# EAGLE schematic opentempescope (EAGLE 7.2.0)
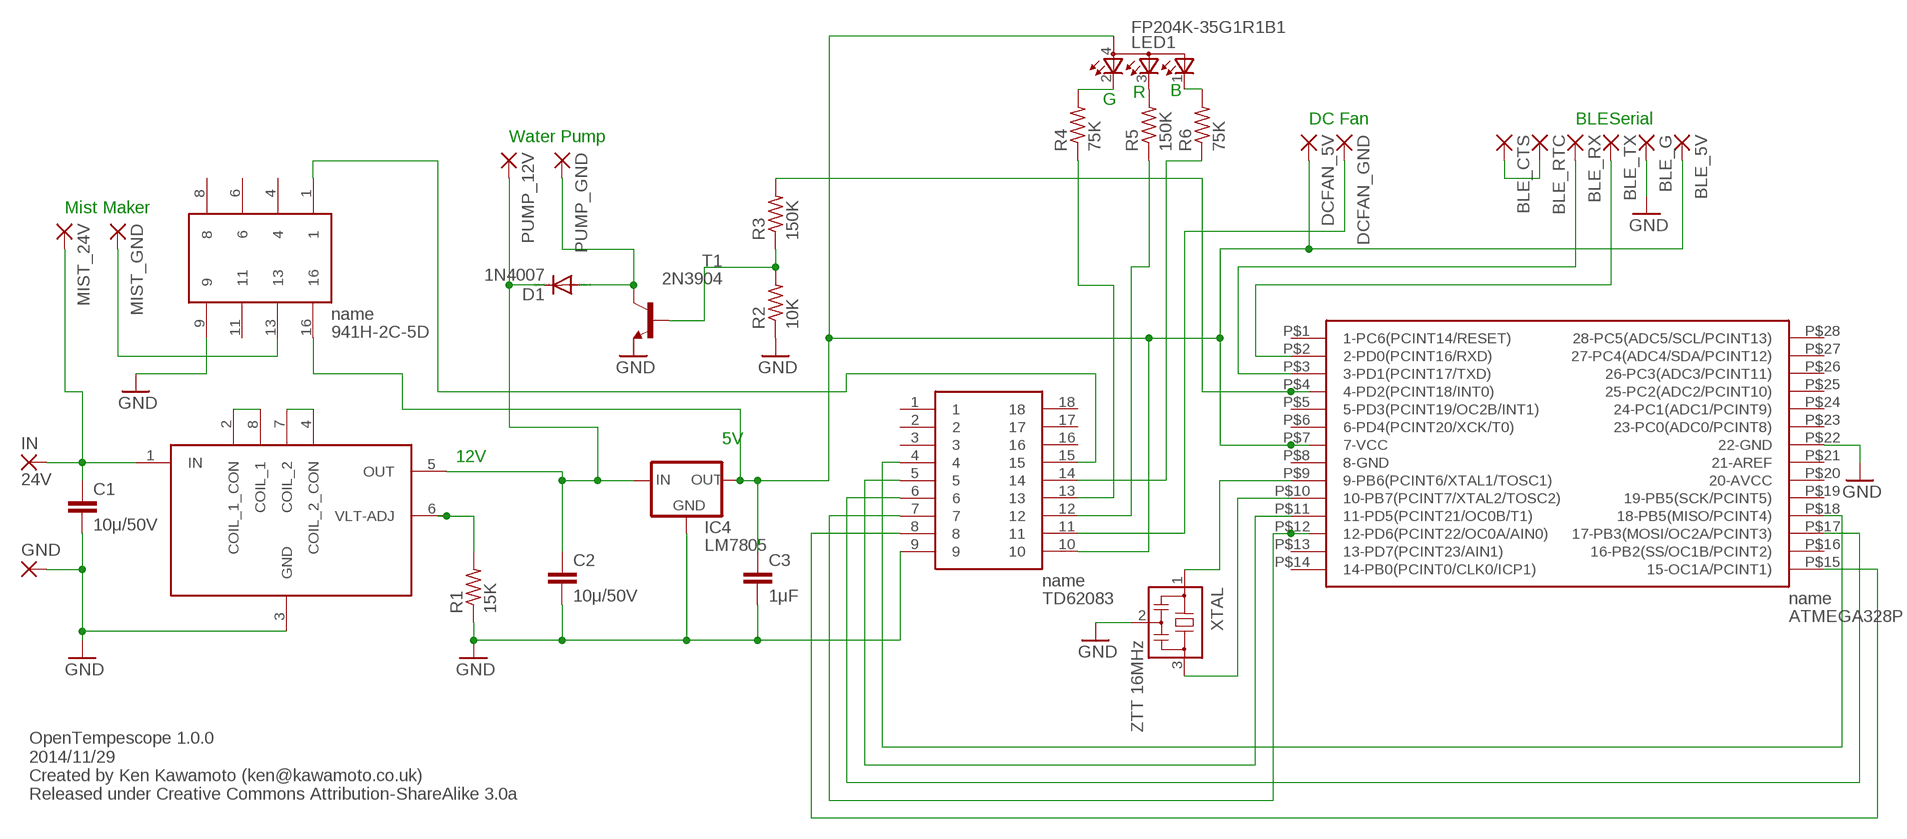
[diagram p0: schematic, sheet 1]

## Parts
BLE_5V  2,15/1,0  [2,15/1,0]
BLE_CTS  2,15/1,0  [2,15/1,0]
BLE_G  2,15/1,0  [2,15/1,0]
BLE_RTC  2,15/1,0  [2,15/1,0]
BLE_RX  2,15/1,0  [2,15/1,0]
BLE_TX  2,15/1,0  [2,15/1,0]
C1  10μ/50V  C-EU050-025X075  [C050-025X075]
C2  10μ/50V  C-EU050-025X075  [C050-025X075]
C3  1μF  C-EU050-025X075  [C050-025X075]
D1  1N4007  1N4004  [DO41-10]
DCFAN_5V  2,15/1,0  [2,15/1,0]
DCFAN_GND  2,15/1,0  [2,15/1,0]
GND  2,15/1,0  [2,15/1,0]
IC2  TD62083  [TD62083]
IC4  LM7805  78XXS  [78XXS]
IN  24V  2,15/1,0  [2,15/1,0]
LED1  FP204K-35G1R1B1  GM1WA55311A  [GM1WA55311A]
MIST_24V  2,15/1,0  [2,15/1,0]
MIST_GND  2,15/1,0  [2,15/1,0]
PUMP_12V  2,15/1,0  [2,15/1,0]
PUMP_GND  2,15/1,0  [2,15/1,0]
R1  15K  R-US_0309/12  [0309/12]
R2  10K  R-US_0309/12  [0309/12]
R3  150K  R-US_0309/12  [0309/12]
R4  75K  R-US_0309/12  [0309/12]
R5  150K  R-US_0309/12  [0309/12]
R6  75K  R-US_0309/12  [0309/12]
T1  2N3904  [TO92]
U$1  HPH05001M  [HPH05001M]
U$2  941H-2C-5D  [941H-2C-5D]
U$3  ATMEGA328P  [ATMEGA328P]
XTAL  ZTT 16MHz  CSTCR6M00G53Z  [CSTCR6M]

## Nets
GND: BLE_G.1(P) C2.2 C3.2 IC2.9 IC4.GND R1.1 R2.1 T1.3(E) U$2.9 U$3.P$22(22-GND) XTAL.2
N$1: C1.2 GND.1(P) U$1.3(GND) ; supply symbol labelled GND
N$2: C1.1 IN.1(P) MIST_24V.1(P) U$1.1(IN)
N$3: U$1.2(COIL_1_CON) U$1.8(COIL_1)
N$4: U$1.4(COIL_2_CON) U$1.7(COIL_2)
N$5: R1.2 U$1.6(VLT-ADJ)
N$6: D1.A PUMP_GND.1(P) T1.1(C)
N$7: MIST_GND.1(P) U$2.13
N$8: C2.1 D1.C IC4.IN PUMP_12V.1(P) U$1.5(OUT)
N$9: R2.2 R3.1 T1.2(B)
N$10: BLE_5V.1(P) C3.1 DCFAN_5V.1(P) IC2.10 IC4.OUT LED1.4(A) U$2.16 U$3.P$7(7-VCC)
N$11: U$2.1
N$12: IC2.15
N$13: LED1.2(CRED) R4.2
N$14: R3.2 U$3.P$4(4-PD2(PCINT18/INT0))
N$15: LED1.3(CBLUE) R5.2
N$16: LED1.1(CGREEN) R6.2
N$17: IC2.13 R4.1
N$18: IC2.12 R5.1
N$19: IC2.14 R6.1
N$20: IC2.4 U$3.P$18(18-PB5(MISO/PCINT4))
N$21: IC2.5 U$3.P$11(11-PD5(PCINT21/OC0B/T1))
N$22: IC2.6 U$3.P$17(17-PB3(MOSI/OC2A/PCINT3))
N$23: IC2.7 U$3.P$12(12-PD6(PCINT22/OC0A/AIN0))
N$24: IC2.8 U$3.P$15(15-OC1A/PCINT1))
N$25: U$3.P$9(9-PB6(PCINT6/XTAL1/TOSC1)) XTAL.1
N$27: U$3.P$10(10-PB7(PCINT7/XTAL2/TOSC2)) XTAL.3
N$28: DCFAN_GND.1(P) IC2.11
N$30: BLE_CTS.1(P) BLE_RTC.1(P)
N$31: BLE_RX.1(P) U$3.P$3(3-PD1(PCINT17/TXD))
N$32: BLE_TX.1(P) U$3.P$2(2-PD0(PCINT16/RXD))
Unconnected: IC2.1 IC2.2 IC2.3 IC2.16 IC2.17 IC2.18 U$2.4 U$2.6 U$2.8 U$2.11 U$3.P$1(1-PC6(PCINT14/RESET)) U$3.P$5(5-PD3(PCINT19/OC2B/INT1)) U$3.P$6(6-PD4(PCINT20/XCK/T0)) U$3.P$8(8-GND) U$3.P$13(13-PD7(PCINT23/AIN1)) U$3.P$14(14-PB0(PCINT0/CLK0/ICP1)) U$3.P$16(16-PB2(SS/OC1B/PCINT2)) U$3.P$19(19-PB5(SCK/PCINT5)) U$3.P$20(20-AVCC) U$3.P$21(21-AREF) U$3.P$23(23-PC0(ADC0/PCINT8)) U$3.P$24(24-PC1(ADC1/PCINT9)) U$3.P$25(25-PC2(ADC2/PCINT10)) U$3.P$26(26-PC3(ADC3/PCINT11)) U$3.P$27(27-PC4(ADC4/SDA/PCINT12)) U$3.P$28(28-PC5(ADC5/SCL/PCINT13))

## Notes on the sheet
- R | B
- G
- DC Fan | BLESerial
- Water Pump
- Mist Maker
- 5V
- 12V
- OpenTempescope 1.0.0
  2014/11/29
  Created by Ken Kawamoto (ken@kawamoto.co.uk)
  Released under Creative Commons Attribution-ShareAlike 3.0a

## Library data of the parts
BLE_5V BLE_CTS BLE_G BLE_RTC BLE_RX BLE_TX DCFAN_5V DCFAN_GND GND IN MIST_24V MIST_GND PUMP_12V PUMP_GND = wirepad:2,15/1,0: THROUGH-HOLE PAD
C1-C3 = resistor:C-EU: CAPACITOR, European symbol
D1 = diode:1N4004: DIODE general purpose rectifier, 1 A
IC2 = kensCustomLibrary:TD62083
IC4 = v-reg:78XXS: VOLTAGE REGULATOR
LED1 = led:GM1WA55311A: Chip LED RGB Source: http://document.sharpsma.com/files/GM1WA55311A_SS.pdf
R1-R6 = resistor:R-US_: RESISTOR, American symbol
T1 = transistor:2N3904: NPN TRANSISTOR
U$1 = kensCustomLibrary:HPH05001M: HPH05001M DC-DC Converter http://akizukidenshi.com/catalog/g/gM-05701/
U$2 = kensCustomLibrary:941H-2C-5D
U$3 = kensCustomLibrary:ATMEGA328P
XTAL = murata-filter:CSTCR: Resonator Source: murata.co.jp; MPN: CSTCR6M00G53-R0; OC_FARNELL: 1170434; OC_NEWARK: 25M8759